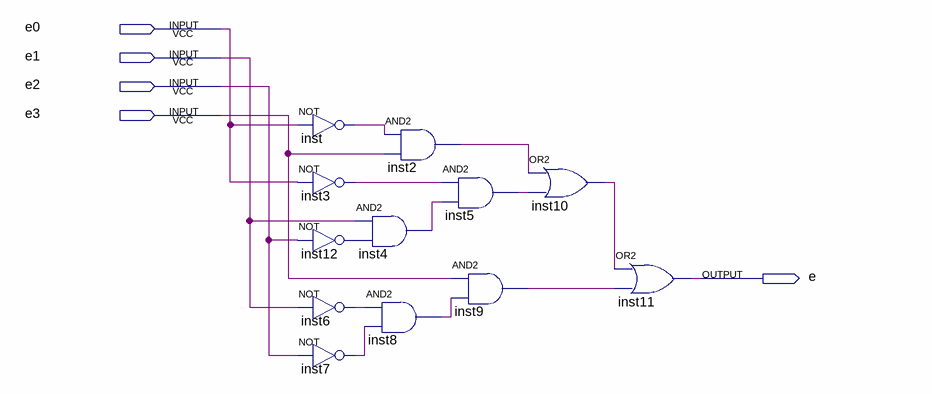
[diagram p0: schematic sheet]
// Quartus schematic e_segment.bdf as structural Verilog: 12 symbols, 5 pins
module e_segment (
  input  e0,
  input  e1,
  input  e2,
  input  e3,
  output e
);

  wire inst2_out, inst3_out, inst4_out, inst5_out, inst6_out, inst7_out, inst8_out, inst9_out, inst10_out,
       inst12_out, inst_out;

  not inst (inst_out, e0);
  not inst3 (inst3_out, e0);
  not inst12 (inst12_out, e2);
  not inst6 (inst6_out, e1);
  not inst7 (inst7_out, e2);
  and inst2 (inst2_out, inst_out, e3);
  and inst4 (inst4_out, e1, inst12_out);
  and inst8 (inst8_out, inst6_out, inst7_out);
  and inst5 (inst5_out, inst3_out, inst4_out);
  and inst9 (inst9_out, e3, inst8_out);
  or inst10 (inst10_out, inst2_out, inst5_out);
  or inst11 (e, inst10_out, inst9_out);
endmodule
